# Altium schematic sheet Trash.SchDoc
size 420 x 297 mm; Address1: Address1; Address2: Address2; Address3: Address3; Address4: Address4; SheetNumber: 1; Scale: 1:1; Разраб.: Иванов; Обозначение документа: АБВГ.123456.001 Э3; Пров.: Петров; Утв.: Сидоров; Наименование организации: ОАО "Концерн "МПО-Гидроприбор"; Перв. применение: АБВГ.123456.000; Наименование изделия 1: Плата; Наименование изделия 2: Схема электрическая; Наименование изделия 3: принципиальная; Нач. отд.: Нач. отд.; Фамилия нач. отд.: Сидоров
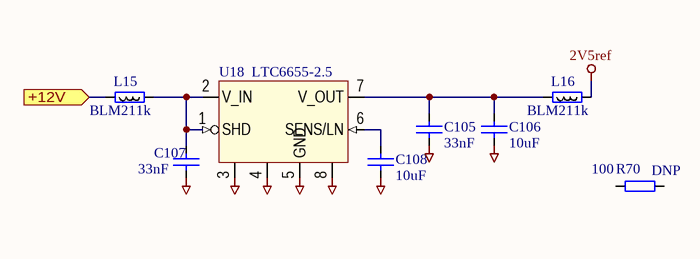
[diagram p0: Trash.SchDoc]

## Parts
C105  33nF  [SMD0805CAP]
C106  10uF  [SMD0805CAP]
C107  33nF  [SMD0805CAP]
C108  10uF  [SMD0805CAP]
L15  BLM211k  [RESC2012X50N]
L16  BLM211k  [RESC2012X50N]
R70  100  Solder Option: DNP  [SMD0805RES]
U18  LTC6655-2.5  [SOP65P488X110-8N]

## Ports
+12V (in)

## Nets
2V5ref: L16.2
GND: C105.2 C106.1 C107.1 C108.1 U18.3(GND) U18.4(GND) U18.5(GND) U18.8(GND)
+12V: L15.1 ; port +12V
NetC105_1: C105.1 C106.2 L16.1 U18.7(V_OUT)
NetC107_2: C107.2 L15.2 U18.1(SHD) U18.2(V_IN)
NetC108_2: C108.2 U18.6(SENS/LN)

Not connected (* = marked no-connect by the designer): R70 1 2

## Notes on the sheet
- Подп. и дата
- Инв. № дубл.
- Взам. инв. №
- Инв. № подл.
- Изм.
- Лист
- № докум.
- Подп.
- Дата
- Копировал
- Формат А3

## Library data of the parts
C105-C108 = C0805: Чип конденсатор 0805; Voltage: 25V; Vendor: Vishay; DielectricType: X5R; SMD Solders: 2; Solder Option: RM; Tolerance: 20%; Pkg: SMD0805; Device: Cap0805; Price: 2
  C105 C107: Value: 33nF
  C106 C108: Value: 10uF
L15 L16 = BLM21: SMD Ferrite bead 0805; Vendor: Vishay; Value: 1k; Pkg: SMD0805; SMD Solders: 2; Solder Option: RM; Price: 10; Device: BLM21
R70 = R0805: Чип резистор 0805; Vendor: Vishay; SMD Solders: 2; TC: 100ppm/C; Tolerance: 1%; Pkg: SMD0805; Pwr: 125mW; Device: Res0805; Price: 2; Value: 100
U18 = LTC6655B-5: Low noise precision reference,; Name to order: LTC6655LNBHMS8-2.5; Pkg: MSOP65-8; SMD Solders: 8; Solder Option: RM; TC: 2ppm/C; Value: -2.5; Vendor: Analog Devices Inc; Voltage: max13.2V; Price: 6000; Device: LTC6655